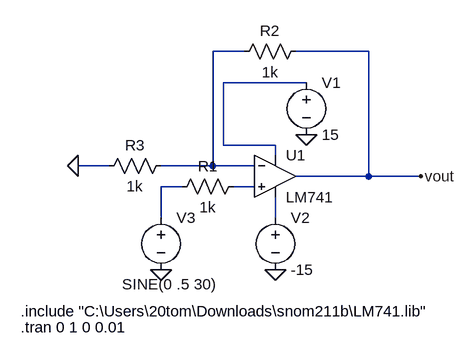
[diagram p0: schematic EXP5 , Q4, NON INVERTING.asc]
EXP5 , Q4, NON INVERTING.asc, the LTspice schematic file:
Version 4.1
SHEET 1 880 680
WIRE 144 -32 96 -32
WIRE 336 -32 224 -32
WIRE 240 16 112 16
WIRE 112 112 112 16
WIRE 192 112 112 112
WIRE 192 128 192 112
WIRE -64 144 -112 144
WIRE 96 144 96 -32
WIRE 96 144 16 144
WIRE 160 144 96 144
WIRE 336 160 336 -32
WIRE 336 160 224 160
WIRE 416 160 336 160
WIRE 48 176 16 176
WIRE 160 176 128 176
WIRE 16 224 16 176
WIRE 192 224 192 192
FLAG -112 144 0
FLAG 416 160 vout
FLAG 16 304 0
FLAG 192 304 0
FLAG 240 96 0
SYMBOL OpAmps\\opamp2 192 96 R0
SYMATTR InstName U1
SYMATTR Value LM741
SYMBOL voltage 240 0 R0
WINDOW 123 0 0 Left 0
WINDOW 39 0 0 Left 0
SYMATTR InstName V1
SYMATTR Value 15
SYMBOL voltage 192 208 R0
WINDOW 123 0 0 Left 0
WINDOW 39 0 0 Left 0
SYMATTR InstName V2
SYMATTR Value -15
SYMBOL voltage 16 208 R0
WINDOW 3 -60 118 Left 2
WINDOW 123 0 0 Left 0
WINDOW 39 0 0 Left 0
SYMATTR Value SINE(0 .5 30)
SYMATTR InstName V3
SYMBOL res 144 160 R90
WINDOW 0 0 56 VBottom 2
WINDOW 3 32 56 VTop 2
SYMATTR InstName R1
SYMATTR Value 1k
SYMBOL res 240 -48 R90
WINDOW 0 0 56 VBottom 2
WINDOW 3 32 56 VTop 2
SYMATTR InstName R2
SYMATTR Value 1k
SYMBOL res 32 128 R90
WINDOW 0 0 56 VBottom 2
WINDOW 3 32 56 VTop 2
SYMATTR InstName R3
SYMATTR Value 1k
TEXT -200 368 Left 2 !.include "C:\\Users\\20tom\\Downloads\\snom211b\\LM741.lib"
TEXT -200 392 Left 2 !.tran 0 1 0 0.01

The netlist it stands for:
* EXP5 , Q4, NON INVERTING.asc
X§U1 N004 N001 N002 N005 vout LM741  ; pins In+ In- V+ V- OUT
V1 N002 0 15
V2 N005 0 -15
V3 N003 0 SINE(0 .5 30)
R1 N004 N003 1k
R2 vout N001 1k
R3 N001 0 1k
.include "C:\Users\20tom\Downloads\snom211b\LM741.lib"
.tran 0 1 0 0.01
.backanno
.end